# EAGLE schematic T32 ref (EAGLE 9.6.2)
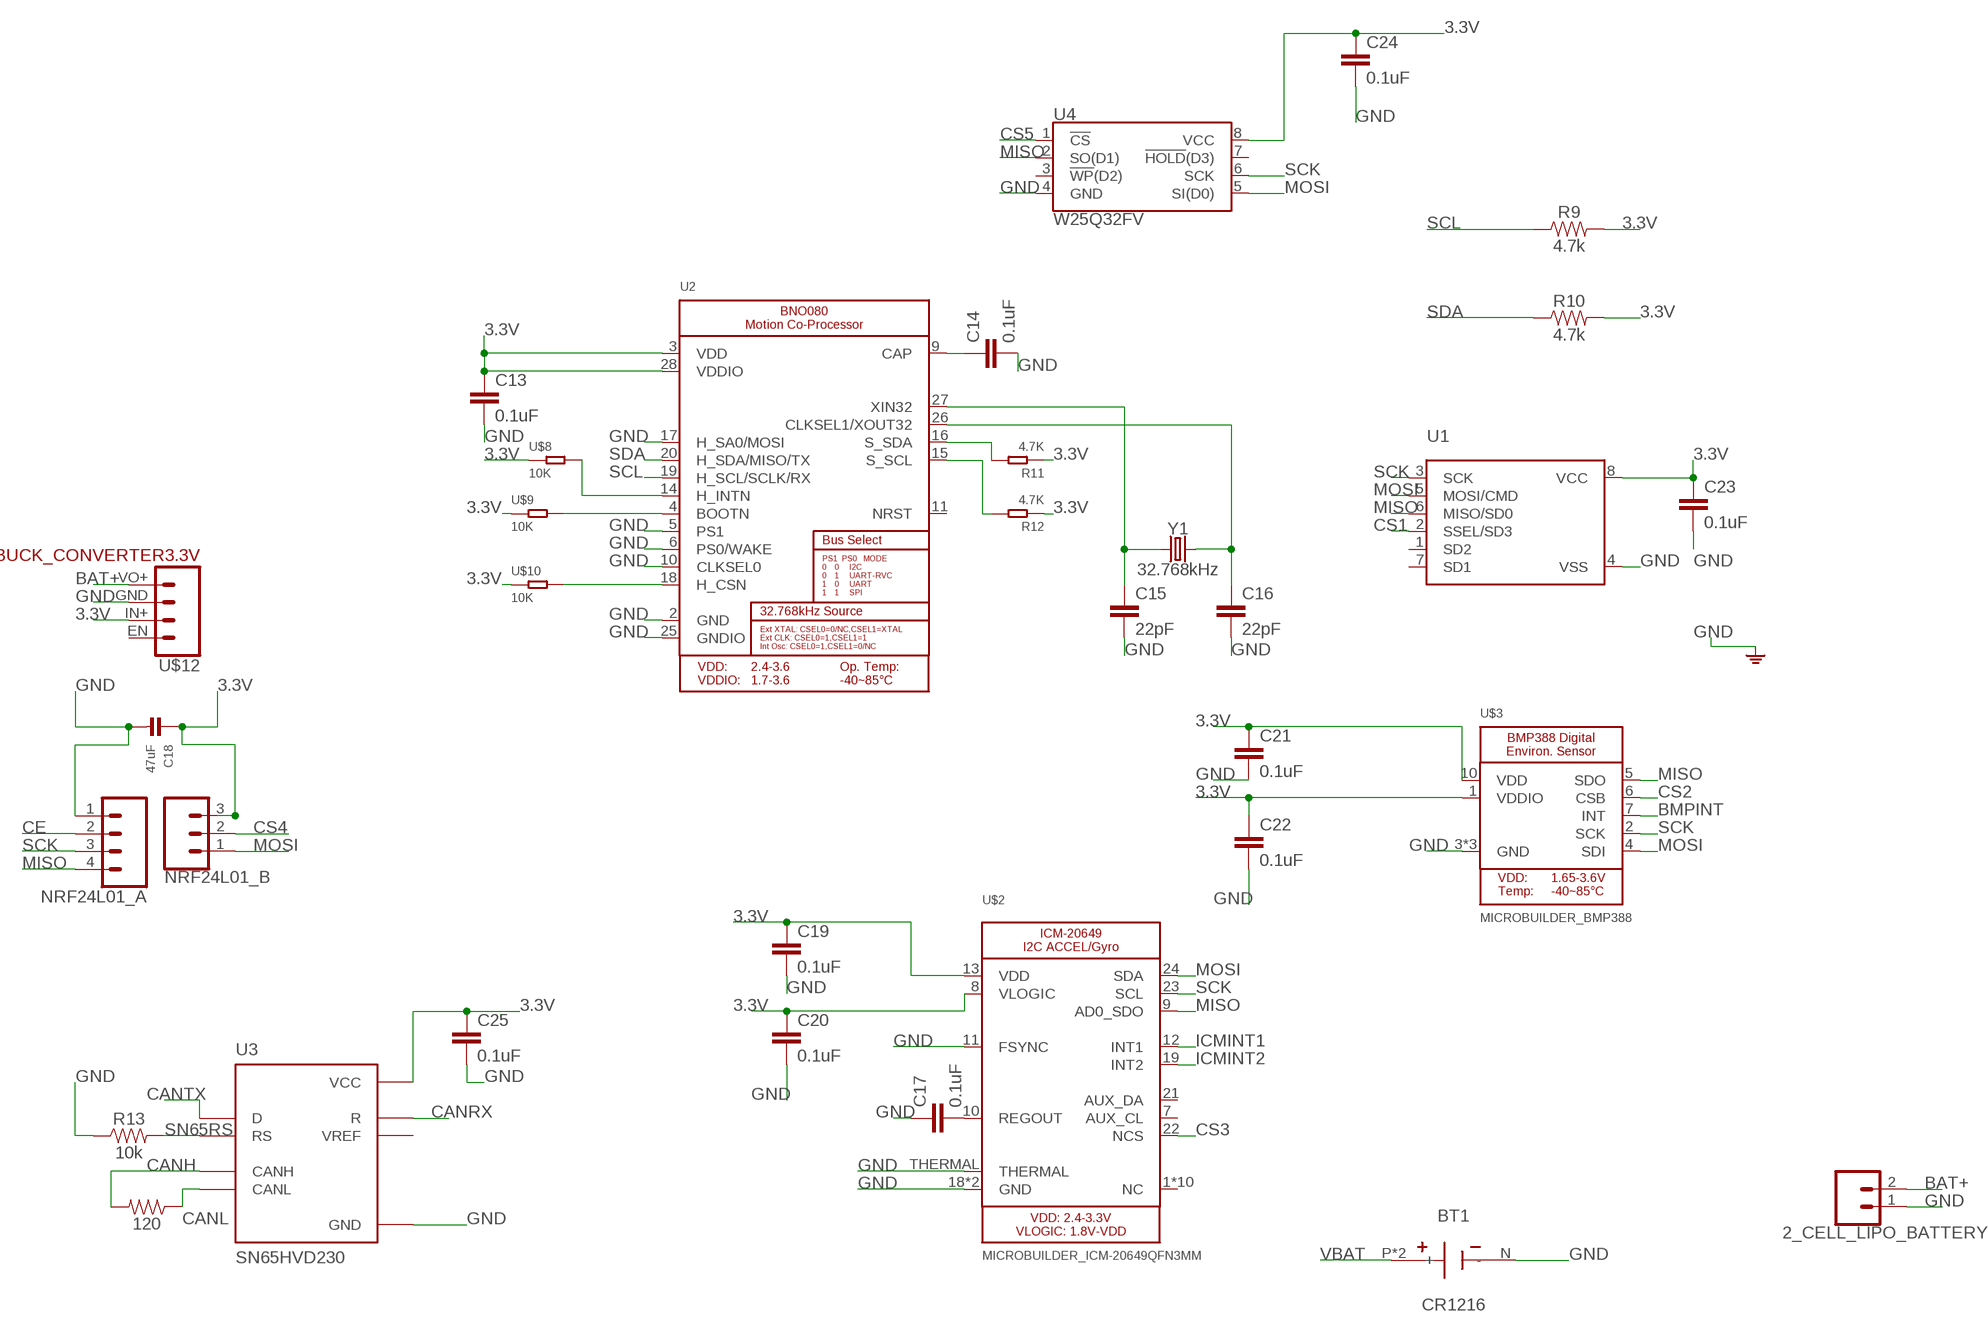
[diagram p0: schematic, sheet 1, part 1 of 2]
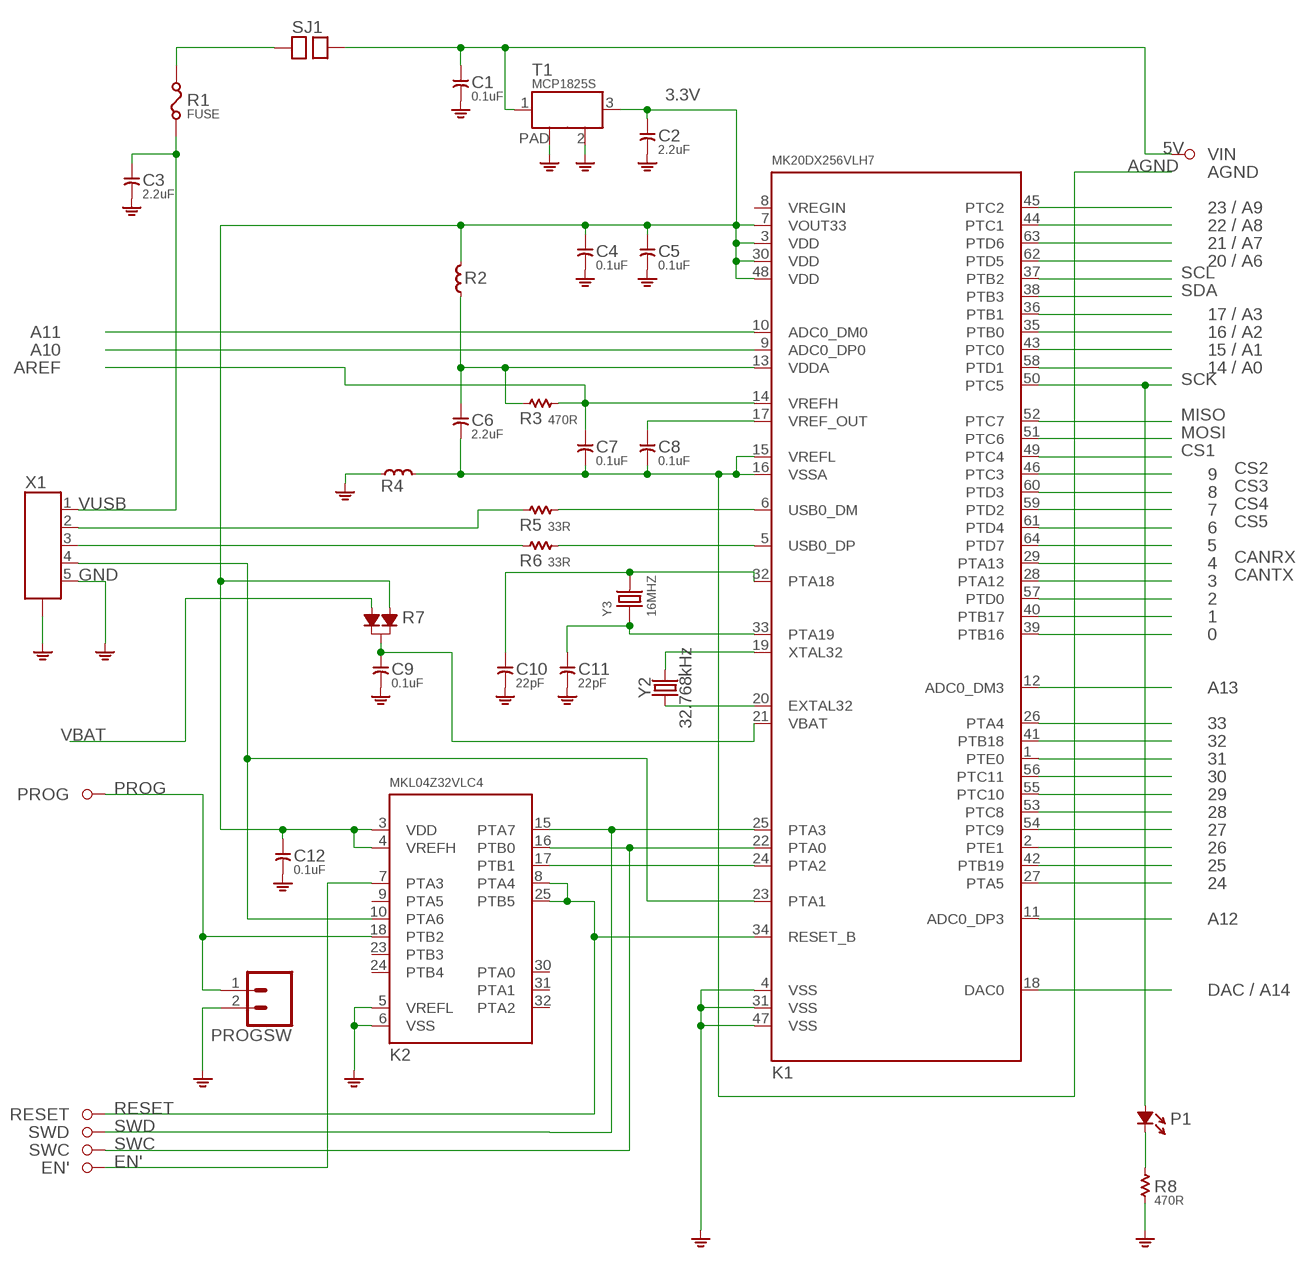
[diagram p1: schematic, sheet 1, part 2 of 2]

## Parts
2_CELL_LIPO_BATTERY  CONN_02  [1X02]
120  RESISTOR1206  [1206]
BT1  CR1216  COIN-CELL-SMT-3P-3000-CR1216  [BAT_3000]
C1  0.1uF  CAPACITOR-0.1UF  [C0603]
C2  2.2uF  CAPACITOR-2.2UF  [C0805]
C3  2.2uF  CAPACITOR-2.2UF  [C0805]
C4  0.1uF  CAPACITOR-0.1UF  [C0603]
C5  0.1uF  CAPACITOR-0.1UF  [C0603]
C6  2.2uF  CAPACITOR-2.2UF  [C0805]
C7  0.1uF  CAPACITOR-0.1UF  [C0603]
C8  0.1uF  CAPACITOR-0.1UF  [C0603]
C9  0.1uF  CAPACITOR-0.1UF  [C0603]
C10  22pF  CAPACITOR-22PF  [C0603]
C11  22pF  CAPACITOR-22PF  [C0603]
C12  0.1uF  CAPACITOR-0.1UF  [C0603]
C13  0.1uF  0.1UF-0402-16V-10%  [0402]
C14  0.1uF  0.1UF-0402-16V-10%  [0402]
C15  22pF  22PF-0603-50V-5%  [0603]
C16  22pF  22PF-0603-50V-5%  [0603]
C17  0.1uF  0.1UF-0402-16V-10%  [0402]
C18  47uF  CAP_CERAMIC0805  [0805]
C19  0.1uF  0.1UF-0603-100V-10%  [0603]
C20  0.1uF  0.1UF-0603-100V-10%  [0603]
C21  0.1uF  0.1UF-0603-100V-10%  [0603]
C22  0.1uF  0.1UF-0603-100V-10%  [0603]
C23  0.1uF  0.1UF-0603-100V-10%  [0603]
C24  0.1uF  0.1UF-0603-100V-10%  [0603]
C25  0.1uF  0.1UF-0603-100V-10%  [0603]
K1  MK20DX256VLH7  [LQFP64-05]
K2  MKL04Z32VLC4  [LQFP32-08]
NRF24L01_A  CONN_04  [1X04]
NRF24L01_B  CONN_03  [1X03]
P1  LED  [LED-0805]
PROGSW  CONN_02  [1X02]
R1  FUSE  [F0805]
R2  FERRITE  [L0603]
R3  470R  RESISTOR-470R  [R0603]
R4  FERRITE  [L0603]
R5  33R  RESISTOR-33R  [R0603]
R6  33R  RESISTOR-33R  [R0603]
R7  DIODE_DUAL  [SOT-23]
R8  470R  RESISTOR-470R  [R0603]
R9  4.7k  4.7KOHM-0603-1/10W-1%  [0603]
R10  4.7k  4.7KOHM-0603-1/10W-1%  [0603]
R11  4.7K  SMD-RES-4.7K-5%-1/16W(0402)  [R0402]
R12  4.7K  SMD-RES-4.7K-5%-1/16W(0402)  [R0402]
R13  10k  10KOHM-0603-1/10W-1%  [0603]
SJ1  SOLDERJUMPER  [SOLDERJUMPER]
SX2  PIN  [PTH_39MIL]
SX38  PIN  [PTH_39MIL]
SX40  PIN  [PTH_39MIL]
SX57  PIN  [PTH_39MIL]
SX58  PIN  [PTH_39MIL]
SX59  PIN  [PTH_39MIL]
T1  MCP1825S  LDO  [SOT-223]
U1  MICROBUILDER_SMT_SDCARD_8PIN  [MICROBUILDER_LGA8_8X6]
U2  MICROBUILDER_BNO080  [MICROBUILDER_BNO080]
U3  SN65HVD230  [SOIC127P599X175-8N]
U4  W25Q32FV  W25Q32FVZP  [WSON8-6X5MM]
U$2  MICROBUILDER_ICM-20649QFN3MM  [MICROBUILDER_QFN24_3MM]
U$3  MICROBUILDER_BMP388  [MICROBUILDER_BMP388]
U$8  10K  SMD-RES-10K-5%-1/(0402)  [R0402]
U$9  10K  SMD-RES-10K-5%-1/(0402)  [R0402]
U$10  10K  SMD-RES-10K-5%-1/(0402)  [R0402]
U$12  BUCK_CONVERTER3.3V  [1X04]
X1  MINI-USB  MINI-USBMOLEX_0675031230  [MOLEX_SD-67503-010]
Y1  32.768kHz  CRYSTAL-32.768KHZSMD-3.2X1.5  [CRYSTAL-SMD-3.2X1.5MM]
Y2  32.768kHz  CRYSTAL-32.768KHZSMD-3.2X1.5  [CRYSTAL-SMD-3.2X1.5MM]
Y3  16MHZ  SMD-CRYSTAL-16MHZ-8PF-20PPM-40R(2P-5.0X3.2MM)  [X2-SMD-5.0X3.2X1.3MM]

## Nets
3.3V: C2.1 C4.1 C5.1 C12.1 C13.1 C18.1 C19.1 C20.1 C21.1 C22.1 C23.1 C24.1 C25.1 K1.3(VDD) K1.7(VOUT33) K1.30(VDD) K1.48(VDD) K2.3(VDD) K2.4(VREFH) NRF24L01_B.3 R2.2 R7.1 R9.2 R10.2 R11.1 R12.1 T1.3(OUT) U1.8(VCC) U2.3(VDD) U2.28(VDDIO) U3.3(VCC) U4.8(VCC) U$2.8(VLOGIC) U$2.13(VDD) U$3.1(VDDIO) U$3.10(VDD) U$8.1 U$9.1 U$10.1 U$12.IN+
5V: C1.1 R1.2 SJ1.1 SJ1.2 SX2.1 T1.1(IN)
AGND: C6.2 C7.2 C8.2 K1.15(VREFL) K1.16(VSSA) R4.2
BAT+: 2_CELL_LIPO_BATTERY.2 U$12.VO+
BMPINT: U$3.7(INT)
CANH: 120.2 U3.7(CANH)
CANL: 120.1 U3.6(CANL)
CANRX: K1.29(PTA13) U3.4(R)
CANTX: K1.28(PTA12) U3.1(D)
CE: NRF24L01_A.2
CS1: K1.49(PTC4) U1.2(SSEL/SD3)
CS2: K1.46(PTC3) U$3.6(CSB)
CS3: K1.60(PTD3) U$2.22(NCS)
CS4: K1.59(PTD2) NRF24L01_B.2
CS5: K1.61(PTD4) U4.1(!CS!)
EN': K2.7(PTA3) SX59.1
GND: 2_CELL_LIPO_BATTERY.1 BT1.N(-) C1.2 C2.2 C3.2 C4.2 C5.2 C9.2 C10.2 C11.2 C12.2 C13.2 C14.2 C15.2 C16.2 C17.1 C18.2 C19.2 C20.2 C21.2 C22.2 C23.2 C24.2 C25.2 K1.4(VSS) K1.31(VSS) K1.47(VSS) K2.5(VREFL) K2.6(VSS) NRF24L01_A.1 PROGSW.2 R4.1 R8.1 R13.1 T1.2(GND) T1.PAD U1.4(VSS) U2.2(GND) U2.5(PS1) U2.6(PS0/WAKE) U2.10(CLKSEL0) U2.17(H_SA0/MOSI) U2.25(GNDIO) U3.2(GND) U4.4(GND) U$2.11(FSYNC) U$2.18(GND) U$2.20(GND) U$2.THERMAL U$3.3(GND) U$3.8(GND) U$3.9(GND) U$12.GND X1.5 X1.P$1(CASE) X1.P$2(CASE) X1.P$3(CASE) X1.P$4(CASE) X1.P$5(CASE) X1.P$6(CASE)
ICMINT1: U$2.12(INT1)
ICMINT2: U$2.19(INT2)
MISO: K1.52(PTC7) NRF24L01_A.4 U1.6(MISO/SD0) U4.2(SO(D1)) U$2.9(AD0_SDO) U$3.5(SDO)
MOSI: K1.51(PTC6) NRF24L01_B.1 U1.5(MOSI/CMD) U4.5(SI(D0)) U$2.24(SDA) U$3.4(SDI)
N$1: K1.19(XTAL32) Y2.P$2
N$2: K1.20(EXTAL32) Y2.P$1
N$3: K1.24(PTA2) K2.17(PTB1)
N$4: C14.1 U2.9(CAP)
N$5: C11.1 K1.33(PTA19) Y3.1
N$7: C10.1 K1.32(PTA18) Y3.2
N$10: K1.5(USB0_DP) R6.2
N$11: C8.1 K1.17(VREF_OUT)
N$13: C7.1 K1.14(VREFH) R3.2
N$14: K1.6(USB0_DM) R5.2
N$15: C6.1 K1.13(VDDA) R2.1 R3.1
N$16: R6.1 X1.3
N$17: R5.1 X1.2
N$19: K1.23(PTA1) K2.10(PTA6) X1.4
N$20: C15.1 U2.27(XIN32) Y1.P$1
N$21: K1.45(PTC2)
N$22: K1.44(PTC1)
N$23: K1.63(PTD6)
N$24: K1.62(PTD5)
N$27: K1.36(PTB1)
N$28: K1.35(PTB0)
N$29: K1.43(PTC0)
N$30: K1.58(PTD1)
N$39: K1.64(PTD7)
N$42: K1.57(PTD0)
N$43: K1.40(PTB17)
N$44: K1.39(PTB16)
N$45: K1.12(ADC0_DM3)
N$46: K1.26(PTA4)
N$47: K1.41(PTB18)
N$48: K1.1(PTE0)
N$49: K1.56(PTC11)
N$50: K1.55(PTC10)
N$51: K1.53(PTC8)
N$52: P1.- R8.2
N$54: K1.18(DAC0)
N$55: K1.11(ADC0_DP3)
N$56: C16.1 U2.26(CLKSEL1/XOUT32) Y1.P$2
N$57: K1.27(PTA5)
N$58: K1.42(PTB19)
N$59: K1.2(PTE1)
N$60: K1.54(PTC9)
N$62: C17.2 U$2.10(REGOUT)
N$64: K1.10(ADC0_DM0)
N$65: K1.9(ADC0_DP0)
N$66: U2.18(H_CSN) U$10.2
N$68: C9.1 K1.21(VBAT) R7.3
N$71: R11.2 U2.16(S_SDA)
N$72: R12.2 U2.15(S_SCL)
N$73: U2.14(H_INTN) U$8.2
N$74: U2.4(BOOTN) U$9.2
PROG: K2.18(PTB2) PROGSW.1 SX40.1
RESET: K1.34(RESET_B) K2.8(PTA4) K2.25(PTB5) SX38.1
SCK: K1.50(PTC5) NRF24L01_A.3 P1.+ U1.3(SCK) U4.6(SCK) U$2.23(SCL) U$3.2(SCK)
SCL: K1.37(PTB2) R9.1 U2.19(H_SCL/SCLK/RX)
SDA: K1.38(PTB3) R10.1 U2.20(H_SDA/MISO/TX)
SN65RS: R13.2 U3.8(RS)
SWC: K1.22(PTA0) K2.16(PTB0) SX58.1
SWD: K1.25(PTA3) K2.15(PTA7) SX57.1
VBAT: BT1.P1(+) BT1.P(+) R7.2
VUSB: C3.1 R1.1 X1.1
Unconnected: K1.8(VREGIN) K2.9(PTA5) K2.23(PTB3) K2.24(PTB4) K2.30(PTA0) K2.31(PTA1) K2.32(PTA2) U1.1(SD2) U1.7(SD1) U2.11(NRST) U3.5(VREF) U4.3(!WP!(D2)) U4.7(!HOLD!(D3)) U$2.1(NC) U$2.2(NC) U$2.3(NC) U$2.4(NC) U$2.5(NC) U$2.6(NC) U$2.7(AUX_CL) U$2.14(NC) U$2.15(NC) U$2.16(NC) U$2.17(NC) U$2.21(AUX_DA) U$12.EN

## Notes on the sheet
- VIN
- AGND
- 23 / A9
- 22 / A8
- 21 / A7
- 20 / A6
- 17 / A3
- A11 | 16 / A2
- A10 | 15 / A1
- AREF | 14 / A0
- 9
- 8
- 7
- 6
- 5
- 4
- 3
- 2
- 1
- 0
- A13
- 33
- 32
- 31
- 30
- PROG | 29
- 28
- 27
- 26
- 25
- 24
- A12
- DAC / A14
- RESET
- SWD
- SWC
- EN'

## Library data of the parts
2_CELL_LIPO_BATTERY PROGSW = SparkFun-Connectors:CONN_02: Multi connection point. Often used as Generic Header-pin footprint for 0.1 inch spaced/style header connections On any of the 0.1 inch spaced packages, you can populate with these: Break Away Headers - Straight <https://www.sparkfun.com/products/116> (PRT-00116) Break Away Male Headers - Right Angle <https://www.sparkfun.com/products/553> (PRT-00553) Female Headers <https://www.sparkfun.com/products/115> (PRT-00115) Break Away Headers - Machine Pin <https://www.sparkfun.com/products/117> (PRT-00117) Break Away Female Headers - Swiss Machine Pin <https://www.sparkfun.com/products/743> (PRT-00743) For SCREWTERMINALS and SPRING TERMINALS visit here: Screw Terimnals on SparkFun.com <https://www.sparkfun.com/search/results?term=Screw+Terminals> (5mm/3.5mm/2.54mm spacing) This device is also useful as a general connection point to wire up your design to another part of your project. Our various solder wires solder well into these plated through hole pads. Hook-Up Wire - Assortment (Stranded, 22 AWG) <https://www.sparkfun.com/products/11375> (PRT-11375) Hook-Up Wire - Assortment (Solid Core, 22 AWG) <https://www.sparkfun.com/products/11367> (PRT-11367) View the entire wire category on our website here <https://www.sparkfun.com/categories/141> Special notes: Molex polarized connector foot print use with: PRT-08233 with associated crimp pins and housings. 2.54_SCREWTERM for use with PRT-10571. 3.5mm Screw Terminal footprints for PRT-08084 5mm Screw Terminal footprints for use with PRT-08432
120 = SparkFun-Resistors:RESISTOR: Generic Resistor Package
BT1 = Battery_Holder:COIN-CELL-SMT-3P-?-: Battery Holders - Coin Cell SMD - CR2032, LR44, SR44 etc. Datasheet <https://docs.rs-online.com/b397/0900766b813ec0e2.pdf>; CATEGORY: Battery-Holder; CELL_DIAMETER: 12mm; DESCRIPTION: Battery Retainer Coin, 12.0mm 1 Cell SMD (SMT) Tab; MANUFACTURER: Keystone Electronics; MPN: 3000; PART_STATUS: ACTIVE; ROHS_COMPLIANT: COMPLIANT; SERIES: -; SUB_CATEGORY: Holder; TYPE: Coin Cell
C1 C4 C5 C7-C9 C12 = t32_ref:CAPACITOR-0.1UF; DESC: 0.1uF / 16VDC / X7R; MF: Murata Electronics; MPN: GRM188R71C104KA01D; OC_MOUSER: 81-GRM39X104K16; PACKAGE: 0603; TYPE: Capacitor
C2 C3 C6 = t32_ref:CAPACITOR-2.2UF; DESC: 2.2uF / 25 VDC / X7R; MF: Taiyo Yuden; MPN: TMK212B7225KG-TR; OC_MOUSER: 963-TMK212B7225KG-TR; PACKAGE: 0805; TYPE: Capacitor
C10 C11 = t32_ref:CAPACITOR-22PF; DESC: 22pF / 50VDC / C0G (NP0); MF: Vishay / Vitramon; MPN: VJ0603A220JXACW1BC; OC_MOUSER: 77-VJ0603A220JXACBC; PACKAGE: 0603; TYPE: Capacitor
C13 C14 C17 = SparkFun-Capacitors:0.1UF: 0.1µF ceramic capacitors A capacitor is a passive two-terminal electrical component used to store electrical energy temporarily in an electric field.; PROD_ID: CAP-12416
C15 C16 = SparkFun-Capacitors:22PF: 22pF ceramic capacitors A capacitor is a passive two-terminal electrical component used to store electrical energy temporarily in an electric field.; PROD_ID: CAP-07876
C18 = microbuilder:CAP_CERAMIC: Ceramic Capacitors 0402 - 0402 Surface Mount Capacitors 16pF 50V 5% [Digikey: 445-4899-2-ND] 18pF 50V 5% [Digikey: 490-1281-2-ND] 22pF 50V 5% [Digikey: 490-1283-2-ND] 68pF 50V 5% [Digikey: 490-1289-2-ND] 0.1uF 10V 10% [Digikey: 490-1318-2-ND] 1.0uF 6.3V 10% [Digikey: 490-1320-2-ND] 0603 - 0603 Surface Mount Capacitors 16 pF 50V 5% [Digikey: 445-5051-2-ND] 22 pF 50V [Digikey: PCC220ACVTR-ND] 33 pF 50V 5% [Digikey: 490-1415-1-ND] 56pF 50V 5% [Digikey: 490-1421-1-ND] 220pF 50V 5% [Digikey: 445-1285-1-ND] 680 pF 50V 2200 pF 50V 5% C0G [Digikey: 445-1297-1-ND] 5600 pF 100V 5% X7R [Digikey: 478-3711-1-ND] 0.1 µF 25V 10% [Digikey: PCC2277TR-ND] 0.22 µF 16V 10% X7R [Digikey: 445-1318-1-ND] 1.0 µF 25V 10% [Digikey: 445-5146-2-ND] 0603 - RF Specific 3pF 250V +/-0.1pF RF [Digikey: 712-1347-1-ND] 18 pF 250V 5% [Digikey: 478-3505-1-ND or 712-1322-1-ND] 56 pF 250V 5% C0G RF [Digikey: 490-4867-1-ND] 68 pF 250V RF [Digikey: 490-4868-1-ND] 0805 - 0805 Surface Mount Capacitors 220 pF 250V 2% RF Ceramic Capacitor [Digikey: 712-1398-1-ND] 1000 pF 50V 2% NP0 Ceramic Capacitor [Digikey: 478-3760-1-ND] 0.1 µF 25V 10% Ceramic Capacitor [Digikey: PCC1828TR-ND] 1.0 µF 16V 10% Ceramic Capacitor[Digikey: 490-1691-2-ND] 10.0 µF 10V 10% Ceramic Capacitor[Digikey: 709-1228-1-ND] 10.0 uF 16V 10% Ceramic Capacitor [Digikey: 478-5165-2-ND] 47 uF 6.3V 20% Ceramic Capacitor [Digikey: 587-1779-1-ND or 399-5506-1-ND] 1206 - 1206 Surface Mount Capacitors 47uF 10V 20% Ceramic Capacitor [Digikey: 490-5528-1-ND or 399-5508-1-ND or 445-6010-1-ND] 100uF 6.3V -20%, +80% Y5V Ceramic Capacitor (Digikey: 490-4512-1-ND, Mouser: 81-GRM31CF50J107ZE1L)
C19-C25 = SparkFun-Capacitors:0.1UF: 0.1µF ceramic capacitors A capacitor is a passive two-terminal electrical component used to store electrical energy temporarily in an electric field.; PROD_ID: CAP-08390
K1 = t32_ref:MK20DX256VLH7; DESC: MK20DX256VLH7; MF: NXP; MPN: MK20DX256VLH7; OC_MOUSER: 841-MK20DX256VLH7; PACKAGE: LQFP-64; TYPE: Microcontroller
K2 = t32_ref:MKL04Z32VLC4; DESC: MKL04Z32VLC4 (preprogrammed); MF: PJRC; MPN: IC_MKL04Z32_TQFP32; PACKAGE: LQFP-32; TYPE: Microcontroller
NRF24L01_A = SparkFun-Connectors:CONN_04: Multi connection point. Often used as Generic Header-pin footprint for 0.1 inch spaced/style header connections On any of the 0.1 inch spaced packages, you can populate with these: Break Away Headers - Straight <https://www.sparkfun.com/products/116> (PRT-00116) Break Away Male Headers - Right Angle <https://www.sparkfun.com/products/553> (PRT-00553) Female Headers <https://www.sparkfun.com/products/115> (PRT-00115) Break Away Headers - Machine Pin <https://www.sparkfun.com/products/117> (PRT-00117) Break Away Female Headers - Swiss Machine Pin <https://www.sparkfun.com/products/743> (PRT-00743) For SCREWTERMINALS and SPRING TERMINALS visit here: Screw Terimnals on SparkFun.com <https://www.sparkfun.com/search/results?term=Screw+Terminals> (5mm/3.5mm/2.54mm spacing) This device is also useful as a general connection point to wire up your design to another part of your project. Our various solder wires solder well into these plated through hole pads. Hook-Up Wire - Assortment (Stranded, 22 AWG) <https://www.sparkfun.com/products/11375> (PRT-11375) Hook-Up Wire - Assortment (Solid Core, 22 AWG) <https://www.sparkfun.com/products/11367> (PRT-11367) View the entire wire category on our website here <https://www.sparkfun.com/categories/141> Special notes: Molex polarized connector foot print use with SKU : PRT-08231 with associated crimp pins and housings. 1MM SMD Version SKU: PRT-10208; PROD_ID: CONN-09696
NRF24L01_B = SparkFun-Connectors:CONN_03: Multi connection point. Often used as Generic Header-pin footprint for 0.1 inch spaced/style header connections On any of the 0.1 inch spaced packages, you can populate with these: Break Away Headers - Straight <https://www.sparkfun.com/products/116> (PRT-00116) Break Away Male Headers - Right Angle <https://www.sparkfun.com/products/553> (PRT-00553) Female Headers <https://www.sparkfun.com/products/115> (PRT-00115) Break Away Headers - Machine Pin <https://www.sparkfun.com/products/117> (PRT-00117) Break Away Female Headers - Swiss Machine Pin <https://www.sparkfun.com/products/743> (PRT-00743) Stackable Header - 3 Pin (Female, 0.1") <https://www.sparkfun.com/products/13875> (PRT-13875) For SCREWTERMINALS and SPRING TERMINALS visit here: Screw Terimnals on SparkFun.com <https://www.sparkfun.com/search/results?term=Screw+Terminals> (5mm/3.5mm/2.54mm spacing) This device is also useful as a general connection point to wire up your design to another part of your project. Our various solder wires solder well into these plated through hole pads. Hook-Up Wire - Assortment (Stranded, 22 AWG) <https://www.sparkfun.com/products/11375> (PRT-11375) Hook-Up Wire - Assortment (Solid Core, 22 AWG) <https://www.sparkfun.com/products/11367> (PRT-11367) View the entire wire category on our website here <https://www.sparkfun.com/categories/141> Special notes: Molex polarized connector foot print use with SKU : PRT-08232 with associated crimp pins and housings.
P1 = t32_ref:LED; DESC: orange; MF: ROHM Semiconductor; MPN: SML-211DTT86; OC_MOUSER: 755-SML-211DTT86; PACKAGE: 0805; TYPE: LED
R1 = t32_ref:FUSE; DESC: 6V / 0.5A; MF: Bel Fuse; MPN: 0ZCK0050FF2E; OC_MOUSER: 530-0ZCK0050FF2E; PACKAGE: 0805; TYPE: PPTC
R2 R4 = t32_ref:FERRITE; DESC: 600R / 100MHz; MF: Murata Electronics; MPN: BLM18AG601SN1D; OC_MOUSER: 81-BLM11A601S; PACKAGE: 0603; TYPE: Ferrite
R3 R8 = t32_ref:RESISTOR-470R; DESC: 470R / 1 % / 0.1 W; MF: Vishay; MPN: CRCW0603470RFKEA; OC_MOUSER: 71-CRCW0603-470-E3; PACKAGE: 0603; TYPE: Resistor
R5 R6 = t32_ref:RESISTOR-33R; DESC: 33R / 1% / 0.25 W; MF: Panasonic; MPN: ERJ-PA3F33R0V; OC_MOUSER: 667-ERJ-PA3F33R0V; PACKAGE: 0603; TYPE: Resistor
R7 = t32_ref:DIODE_DUAL; DESC: Dual Schottky, common cat; MF: NXP Semiconductors; MPN: BAT54C,215; OC_MOUSER: 771-BAT54C-T/R; PACKAGE: SOT-23; TYPE: Diode
R9 R10 = SparkFun-Resistors:4.7KOHM: 4.7kΩ resistor A resistor is a passive two-terminal electrical component that implements electrical resistance as a circuit element. Resistors act to reduce current flow, and, at the same time, act to lower voltage levels within circuits. - Wikipedia; PROD_ID: RES-07857
R11 R12 = OPL_Resistor:SMD-RES-4.7K-5%-1/16W(0402): 301012026; MPN: RC0402JR-074K7L
R13 = SparkFun-Resistors:10KOHM: 10kΩ resistor A resistor is a passive two-terminal electrical component that implements electrical resistance as a circuit element. Resistors act to reduce current flow, and, at the same time, act to lower voltage levels within circuits. - Wikipedia; PROD_ID: RES-00824
SJ1 = t32_ref:SOLDERJUMPER
SX2 SX38 SX40 SX57-SX59 = t32_ref:PIN
T1 = t32_ref:LDO; DESC: 3.3V 500mA; MF: Microchip Technology; MPN: MCP1825S-3302E/DB; OC_MOUSER: 579-MCP1825S-3302EDB; PACKAGE: SOT-223-3; TYPE: Voltage regulator
U1 = Adafruit SPI Flash SD Card:MICROBUILDER_SMT_SDCARD_8PIN: SOIC8 SPI Flash Be careful with the size since SOIC8 flash comes in several 'widths' SOIC8 150 mil M25P16 - 16Mbit (2Mbit x 8) Serial Flash (75MHz SPI Bus), Supply: 2.7-3.6V Digikey: SOIC8 - M25P16-VMN6P-ND SOIC8 208 mil W25Q16BVSSIG - 16Mbit (2Mbit x 8) Serial Flash (104MHz SPI Bus), Supply: 2.7-3.6V Digikey: SOIC8 - W25Q16BVSSIG-ND
U2 = Adafruit_BNO08x:MICROBUILDER_BNO080: BNO080 - Motion Co-Processor
U3 = SN65HVD230:SN65HVD230: the sn65hvd230 sn65hvd231 and sn65hvd232 controller area network (can) transceivers are designed for use with the tex... Check prices <https://pricing.snapeda.com/parts/SN65HVD230/Texas%20Instruments/view-part?ref=eda>; AVAILABILITY: In Stock; DESCRIPTION: 1/1 Transceiver Half CANbus 8-SOIC; MF: Texas Instruments; MP: SN65HVD230; PACKAGE: SOIC-8 Texas Instruments; PRICE: None; PURCHASE-URL: https://pricing.snapeda.com/search/part/SN65HVD230/?ref=eda
U4 = SparkFun-IC-Memory:W25Q32FV: W25Q32FV 32Mb (4MB) Serial Flash Memory The W25Q32FV support the standard Serial Peripheral Interface (SPI), Dual/Quad I/O SPI as well as 2-clocks instruction cycle Quad Peripheral Interface (QPI). 104MHz, SPI, 8-SOIC-EIAJ Datasheet <http://www.winbond.com/resource-files/w25q32fv%20revh%20091613.pdf> SparkFun Products SparkFun Blynk Board - ESP8266 <https://www.sparkfun.com/products/13794> (WRL-13794); PROD_ID: NA-XXXXX
U$2 = Adaruit ICM20649:MICROBUILDER_ICM-20649
U$3 = Adafruit BMP390:MICROBUILDER_BMP388
U$8-U$10 = OPL_Resistor:SMD-RES-10K-5%-1/(0402): 301010004; MPN: RC0402JR-0710KL
U$12 = BLTFootprints:BUCK_CONVERTER; VOLTAGE: 3.3V
X1 = t32_ref:MINI-USB; DESC: MINI USB; MF: MOLEX; MPN: 0675031020; OC_MOUSER: 538-67503-1020; TYPE: Mini USB
Y1 Y2 = SparkFun-Clocks:CRYSTAL-32.768KHZ: 32.768kHz Crystal Frequency: 32.768kHz Frequency Stability: ±20ppm Load Capacitance: 12.5pF (PTH-2X6 & SMD-3.2X1.5), 6pF (SMD-2X6) SparkFun Products: SparkFun BigTime Watch Kit <https://www.sparkfun.com/products/11734> SparkFun nRF52832 Breakout <https://www.sparkfun.com/products/13990> SparkFun Real Time Clock Module <https://www.sparkfun.com/products/12708>; PROD_ID: XTAL-13062
Y3 = OPL_Crystal Oscillator:SMD-CRYSTAL-16MHZ-8PF-20PPM-40R(2P-5.0X3.2MM): 306010054; MPN: X053201602002